# EAGLE schematic atmel_midi_cv_basic (EAGLE 7.1.0)
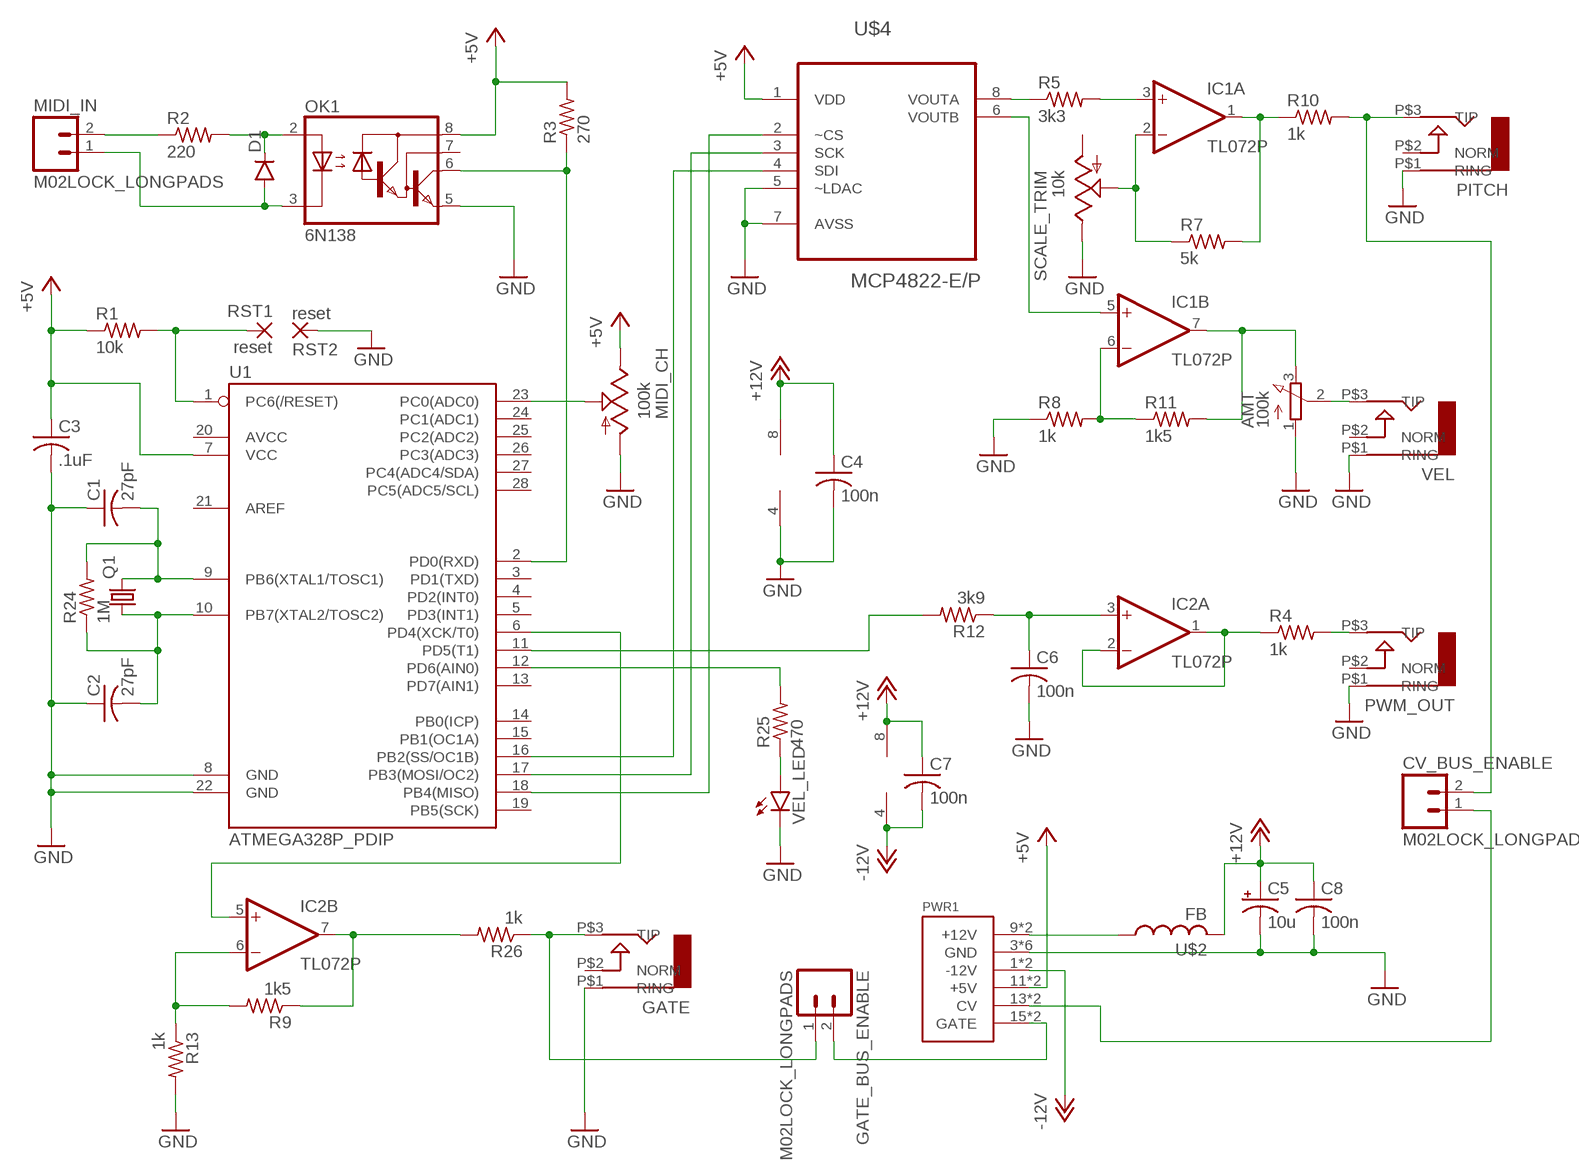
[diagram p0: schematic, sheet 1]

## Parts
AMT  100k  3RP/1610N  [3RP/1610N]
C1  27pF  C-US025-040X050  [C025-040X050]
C2  27pF  C-US025-040X050  [C025-040X050]
C3  .1uF  C-US050-024X044  [C050-024X044]
C4  100n  C-US050-024X044  [C050-024X044]
C5  10u  CPOL-USB45181A  [B45181A]
C6  100n  C-US050-024X044  [C050-024X044]
C7  100n  C-US050-024X044  [C050-024X044]
C8  100n  C-US050-024X044  [C050-024X044]
CV_BUS_ENABLE  M02LOCK_LONGPADS  [1X02_LOCK_LONGPADS]
D1  DIODE1N4148  [DIODE-1N4148]
GATE  AUDIO-JACK  [ERTHENVAR-JACK-90DEG]
GATE_BUS_ENABLE  M02LOCK_LONGPADS  [1X02_LOCK_LONGPADS]
IC1  TL072P  [DIL08]
IC2  TL072P  [DIL08]
MIDI_CH  100k  TRIM_US-B64W  [B64W]
MIDI_IN  M02LOCK_LONGPADS  [1X02_LOCK_LONGPADS]
OK1  6N138  [DIL08]
PITCH  AUDIO-JACK  [ERTHENVAR-JACK-90DEG]
PWM_OUT  AUDIO-JACK  [ERTHENVAR-JACK-90DEG]
PWR1  POWER  [POWER_16]
Q1  CRYSTALHC49S  [HC49/S]
R1  10k  R-US_0207/7  [0207/7]
R2  220  R-US_0207/7  [0207/7]
R3  270  R-US_0207/7  [0207/7]
R4  1k  R-US_0207/7  [0207/7]
R5  3k3  R-US_0207/7  [0207/7]
R7  5k  R-US_0207/7  [0207/7]
R8  1k  R-US_0207/7  [0207/7]
R9  1k5  R-US_0207/7  [0207/7]
R10  1k  R-US_0207/7  [0207/7]
R11  1k5  R-US_0207/7  [0207/7]
R12  3k9  R-US_0207/7  [0207/7]
R13  1k  R-US_0207/7  [0207/7]
R24  1M  R-US_0207/7  [0207/7]
R25  470  R-US_0207/7  [0207/7]
R26  1k  R-US_0207/7  [0207/7]
RST1  reset  2,54/0,9  [2,54/0,9]
RST2  reset  2,54/0,9  [2,54/0,9]
SCALE_TRIM  10k  TRIM_US-B64W  [B64W]
U1  ATMEGA328P_PDIP  [DIL28-3]
U$2  FB  [FB]
U$4  MCP4822-E/P  [DIP254P762X432-8]
VEL  AUDIO-JACK  [ERTHENVAR-JACK-90DEG]
VEL_LED  LED5MM  [LED5MM]

## Nets
+5V: C3.1 MIDI_CH.E OK1.8(VCC) PWR1.11(+5V) PWR1.12(+5V) R1.1 R3.2 U1.7(VCC) U$4.1(VDD)
+12V: C4.1 C5.+ C7.1 C8.1 IC1.8(P:V+) IC2.8(P:V+) U$2.P$2
-12V: C7.2 IC2.4(P:V-) PWR1.1(-12V) PWR1.2(-12V)
GND: VEL_LED.K(C)
N$1: GATE_BUS_ENABLE.2 PWR1.15(GATE) PWR1.16(GATE)
N$2: R5.1 U$4.8(VOUTA)
N$3: D1.A MIDI_IN.1 OK1.3(C)
N$4: C1.2 Q1.2 R24.2 U1.9(PB6(XTAL1/TOSC1))
N$5: C2.2 Q1.1 R24.1 U1.10(PB7(XTAL2/TOSC2))
N$6: IC1.3(A:+IN) R5.2
N$7: D1.C OK1.2(A) R2.2
N$8: MIDI_IN.2 R2.1
N$9: CV_BUS_ENABLE.2 PITCH.P$3(TIP) R10.2
N$10: IC2.6(B:-IN) R9.2 R13.1
N$11: PWR1.9(+12V) PWR1.10(+12V) U$2.P$1
N$12: IC1.2(A:-IN) R7.1 SCALE_TRIM.S
N$13: IC1.6(B:-IN) R8.2 R11.1
N$14: IC1.5(B:+IN) U$4.6(VOUTB)
N$15: CV_BUS_ENABLE.1 PWR1.13(CV) PWR1.14(CV)
N$16: IC2.7(B:OUT) R9.1 R26.2
N$17: AMT.3(E) IC1.7(B:OUT) R11.2
N$18: R25.1 VEL_LED.A
N$19: MIDI_CH.S U1.23(PC0(ADC0))
N$20: R25.2 U1.12(PD6(AIN0))
N$21: R12.2 U1.11(PD5(T1))
N$22: IC2.5(B:+IN) U1.6(PD4(XCK/T0))
N$23: IC2.1(A:OUT) IC2.2(A:-IN) R4.1
N$24: PWM_OUT.P$3(TIP) R4.2
N$25: U1.17(PB3(MOSI/OC2)) U$4.3(SCK)
N$26: U1.16(PB2(SS/OC1B)) U$4.4(SDI)
N$27: IC1.1(A:OUT) R7.2 R10.1
N$28: C6.1 IC2.3(A:+IN) R12.1
N$29: AMT.1(A) C1.1 C2.1 C3.2 C4.2 C5.- C6.2 C8.2 GATE.P$1(RING) IC1.4(P:V-) MIDI_CH.A OK1.5(GND) PITCH.P$1(RING) PWM_OUT.P$1(RING) PWR1.3(GND) PWR1.4(GND) PWR1.5(GND) PWR1.6(GND) PWR1.7(GND) PWR1.8(GND) R8.1 R13.2 RST2.1(P) SCALE_TRIM.E U1.8(GND) U1.22(GND) U$4.5(~LDAC) U$4.7(AVSS) VEL.P$1(RING) ; supply symbol labelled GND
N$30: OK1.6(VO) R3.1 U1.2(PD0(RXD))
N$31: GATE.P$3(TIP) GATE_BUS_ENABLE.1 R26.1
N$43: R1.2 RST1.1(P) U1.1(PC6(/RESET))
N$45: U1.18(PB4(MISO)) U$4.2(~CS)
N$51: AMT.2(S) VEL.P$3(TIP)
Unconnected: GATE.P$2(NORM) OK1.7(VB) PITCH.P$2(NORM) PWM_OUT.P$2(NORM) SCALE_TRIM.A U1.3(PD1(TXD)) U1.4(PD2(INT0)) U1.5(PD3(INT1)) U1.13(PD7(AIN1)) U1.14(PB0(ICP)) U1.15(PB1(OC1A)) U1.19(PB5(SCK)) U1.20(AVCC) U1.21(AREF) U1.24(PC1(ADC1)) U1.25(PC2(ADC2)) U1.26(PC3(ADC3)) U1.27(PC4(ADC4/SDA)) U1.28(PC5(ADC5/SCL)) VEL.P$2(NORM)

## Library data of the parts
AMT = pot:3RP/1610N: 16mm Potentiometer one level Source: http://www.alphapotentiometers.net/html/16mm_pot_2.html
C1-C4 C6-C8 = rcl:C-US: CAPACITOR, American symbol
C5 = rcl:CPOL-US: POLARIZED CAPACITOR, American symbol
CV_BUS_ENABLE GATE_BUS_ENABLE MIDI_IN = SparkFun-Connectors:M02: Standard 2-pin 0.1" header. Use with - straight break away headers ( PRT-00116) - right angle break away headers (PRT-00553) - swiss pins (PRT-00743) - machine pins (PRT-00117) - female headers (PRT-00115) Molex polarized connector foot print use with: PRT-08233 with associated crimp pins and housings. 2.54_SCREWTERM for use with PRT-10571. 3.5mm Screw Terminal footprints for PRT-08084 5mm Screw Terminal footprints for use with PRT-08432
D1 = SparkFun-DiscreteSemi:DIODE: Diode These are standard reverse protection diodes and small signal diodes. SMA package can handle up to about 1A. SOD-323 can handle about 200mA. What the SOD-323 package when ordering, there are some mfgs out there that are 5-pin packages.
GATE PITCH PWM_OUT VEL = erthenvar:AUDIO-JACK: Switching Mono 3.5mm Audio Jack from Erthenvar.
IC1 IC2 = linear:TL072: OP AMP
MIDI_CH SCALE_TRIM = pot:TRIM_US-: POTENTIOMETER
OK1 = optocoupler:6N138: MOTOROLA OPTO COUPLER; MF: VISHAY/TELEFUNKEN; MPN: 6N138; OC_FARNELL: 9860150; OC_NEWARK: 35K5294
PWR1 = eurorack:POWER
Q1 = crystal:CRYSTAL: CRYSTAL; OC_FARNELL: 1667008; OC_NEWARK: unknown
R1-R5 R7-R13 R24-R26 = rcl:R-US_: RESISTOR, American symbol
RST1 RST2 = wirepad:2,54/0,9: THROUGH-HOLE PAD
U1 = SparkFun-DigitalIC:ATMEGA328P_PDIP: uC used in the Arduino 32kb flash, 1k EEPROM, 2k SRAM This is the through-hole version of this chip.
U$2 = adafruit:FB: Ferrite bead Digikey #P9821BK-ND
U$4 = MCP4822:MCP4822-E/P: DAC; MPN: MCP4822-E/P; OC_FARNELL: 1439413; OC_NEWARK: 11M1705; PACKAGE: DIP-8; SUPPLIER: Microchip
VEL_LED = SparkFun-LED:LED: LEDs Standard schematic elements and footprints for 5mm, 3mm, 1206, and 0603 sized LEDs. 5mm - Spark Fun Electronics SKU : COM-00529 (and others)

## Net classes
1 GND: width 1.016 mm, drill 1.016 mm, clearance 0.508 mm